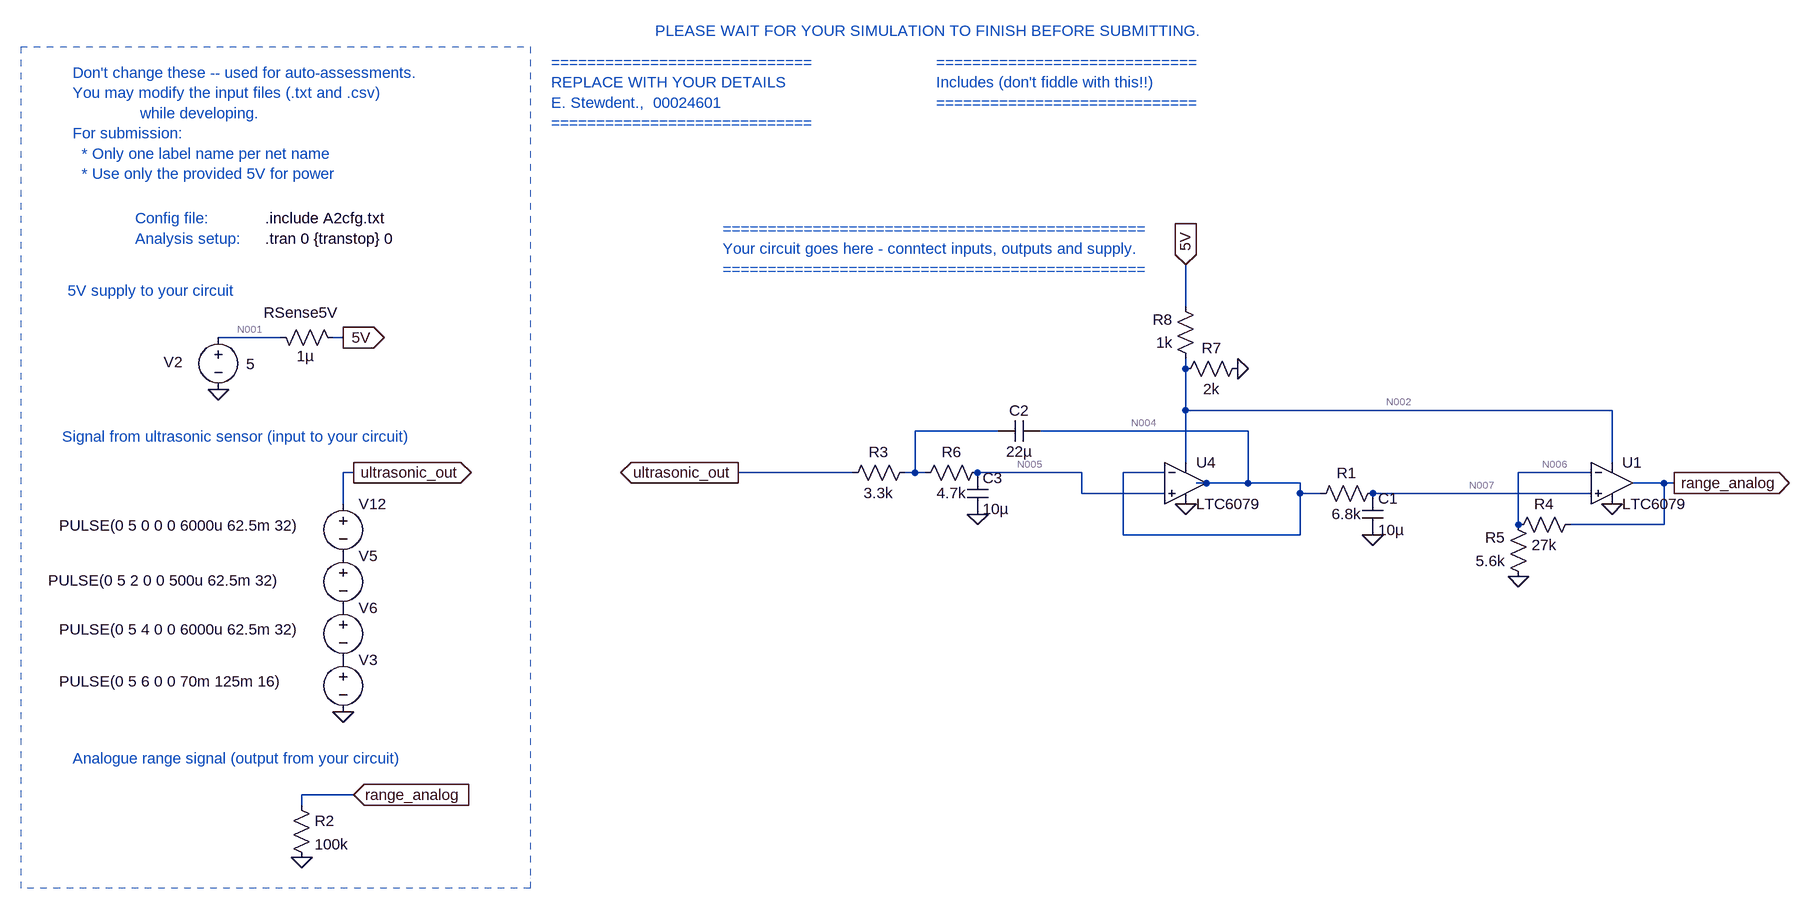
[diagram p0: schematic E344_Ass2_US2A - Copy.asc]
E344_Ass2_US2A - Copy.asc, the LTspice schematic file:
Version 4
SHEET 1 3140 2124
WIRE -576 -1024 -576 -1088
WIRE -1968 -976 -2064 -976
WIRE -1872 -976 -1888 -976
WIRE -576 -928 -576 -944
WIRE -576 -864 -576 -928
WIRE 80 -864 -576 -864
WIRE -864 -832 -992 -832
WIRE -480 -832 -800 -832
WIRE -576 -784 -576 -864
WIRE 80 -784 80 -864
WIRE -1856 -768 -1872 -768
WIRE -1088 -768 -1264 -768
WIRE -992 -768 -992 -832
WIRE -992 -768 -1008 -768
WIRE -976 -768 -992 -768
WIRE -736 -768 -896 -768
WIRE -608 -768 -672 -768
WIRE 48 -768 -64 -768
WIRE -544 -752 -560 -752
WIRE -480 -752 -480 -832
WIRE -480 -752 -544 -752
WIRE -400 -752 -480 -752
WIRE 160 -752 112 -752
WIRE 176 -752 160 -752
WIRE -736 -736 -736 -768
WIRE -608 -736 -736 -736
WIRE -400 -736 -400 -752
WIRE -368 -736 -400 -736
WIRE 48 -736 -288 -736
WIRE -1872 -720 -1872 -768
WIRE -64 -688 -64 -768
WIRE 160 -688 160 -752
WIRE 160 -688 16 -688
WIRE -672 -672 -672 -768
WIRE -400 -672 -400 -736
WIRE -400 -672 -672 -672
WIRE -1856 -272 -1936 -272
WIRE -1936 -256 -1936 -272
FLAG -1872 -976 5V
IOPIN -1872 -976 Out
FLAG -2064 -896 0
FLAG -576 -1088 5V
IOPIN -576 -1088 In
FLAG -1872 -400 0
FLAG -1856 -768 ultrasonic_out
IOPIN -1856 -768 Out
FLAG -1264 -768 ultrasonic_out
IOPIN -1264 -768 Out
FLAG 176 -752 range_analog
IOPIN 176 -752 Out
FLAG -1856 -272 range_analog
IOPIN -1856 -272 In
FLAG -1936 -176 0
FLAG -576 -720 0
FLAG -896 -704 0
FLAG -496 -928 0
FLAG 80 -720 0
FLAG -64 -608 0
FLAG -288 -672 0
SYMBOL voltage -2064 -992 R0
WINDOW 123 0 0 Left 0
WINDOW 39 0 0 Left 0
WINDOW 0 -84 54 Left 2
WINDOW 3 43 57 Left 2
SYMATTR InstName V2
SYMATTR Value 5
SYMBOL res -1984 -992 M90
WINDOW 0 -7 47 VBottom 2
WINDOW 3 29 54 VTop 2
SYMATTR InstName RSense5V
SYMATTR Value 1µ
SYMBOL Opamps\\LTC6079 -576 -752 R0
SYMATTR InstName U4
SYMBOL voltage -1872 -736 R0
WINDOW 123 0 0 Left 0
WINDOW 39 0 0 Left 0
WINDOW 3 -437 49 Left 2
SYMATTR Value PULSE(0 5 0 0 0 6000u 62.5m 32)
SYMATTR InstName V12
SYMBOL voltage -1872 -656 R0
WINDOW 123 0 0 Left 0
WINDOW 39 0 0 Left 0
WINDOW 3 -454 54 Left 2
SYMATTR Value PULSE(0 5 2 0 0 500u 62.5m 32)
SYMATTR InstName V5
SYMBOL voltage -1872 -576 R0
WINDOW 123 0 0 Left 0
WINDOW 39 0 0 Left 0
WINDOW 3 -437 49 Left 2
SYMATTR Value PULSE(0 5 4 0 0 6000u 62.5m 32)
SYMATTR InstName V6
SYMBOL voltage -1872 -496 R0
WINDOW 123 0 0 Left 0
WINDOW 39 0 0 Left 0
WINDOW 3 -437 49 Left 2
SYMATTR Value PULSE(0 5 6 0 0 70m 125m 16)
SYMATTR InstName V3
SYMBOL res -1952 -272 R0
SYMATTR InstName R2
SYMATTR Value 100k
SYMBOL res -992 -784 R90
WINDOW 0 0 56 VBottom 2
WINDOW 3 32 56 VTop 2
SYMATTR InstName R3
SYMATTR Value 3.3k
SYMBOL cap -800 -848 R90
WINDOW 0 0 32 VBottom 2
WINDOW 3 32 32 VTop 2
SYMATTR InstName C2
SYMATTR Value 22µ
SYMBOL cap -912 -768 R0
SYMATTR InstName C3
SYMATTR Value 10µ
SYMBOL res -880 -784 R90
WINDOW 0 0 56 VBottom 2
WINDOW 3 32 56 VTop 2
SYMATTR InstName R6
SYMATTR Value 4.7k
SYMBOL res -480 -944 R90
WINDOW 0 0 56 VBottom 2
WINDOW 3 32 56 VTop 2
SYMATTR InstName R7
SYMATTR Value 2k
SYMBOL res -560 -928 R180
WINDOW 0 36 76 Left 2
WINDOW 3 36 40 Left 2
SYMATTR InstName R8
SYMATTR Value 1k
SYMBOL cap -304 -736 R0
SYMATTR InstName C1
SYMATTR Value 10µ
SYMBOL res -272 -752 R90
WINDOW 0 0 56 VBottom 2
WINDOW 3 32 56 VTop 2
SYMATTR InstName R1
SYMATTR Value 6.8k
SYMBOL res 32 -704 R90
WINDOW 0 0 56 VBottom 2
WINDOW 3 32 56 VTop 2
SYMATTR InstName R4
SYMATTR Value 27k
SYMBOL res -48 -592 R180
WINDOW 0 36 76 Left 2
WINDOW 3 36 40 Left 2
SYMATTR InstName R5
SYMATTR Value 5.6k
SYMBOL Opamps\\LTC6079 80 -752 R0
SYMATTR InstName U1
TEXT -1992 -1128 Left 2 !.tran 0 {transtop} 0
TEXT -1992 -1160 Left 2 !.include A2cfg.txt
TEXT -2288 -1384 Left 2 ;Don't change these -- used for auto-assessments.\nYou may modify the input files (.txt and .csv) \n               while developing.\nFor submission: \n  * Only one label name per net name\n  * Use only the provided 5V for power
TEXT -2192 -1160 Left 2 ;Config file:
TEXT -2192 -1128 Left 2 ;Analysis setup:
TEXT -1552 -1400 Left 2 ;=============================\nREPLACE WITH YOUR DETAILS\nE. Stewdent.,  00024601\n=============================
TEXT -960 -1400 Left 2 ;=============================\nIncludes (don't fiddle with this!!)\n=============================
TEXT -1288 -1144 Left 2 ;===============================================\nYour circuit goes here - conntect inputs, outputs and supply.\n===============================================
TEXT -1392 -1448 Left 2 ;PLEASE WAIT FOR YOUR SIMULATION TO FINISH BEFORE SUBMITTING.
TEXT -2304 -824 Left 2 ;Signal from ultrasonic sensor (input to your circuit)
TEXT -2296 -1048 Left 2 ;5V supply to your circuit
TEXT -2288 -328 Left 2 ;Analogue range signal (output from your circuit)
LINE Normal -1584 -1424 -1584 -128 2
LINE Normal -2368 -1424 -1584 -1424 2
LINE Normal -1584 -128 -2368 -128 2
LINE Normal -1584 -144 -1584 -144 2
LINE Normal -2368 -1424 -2368 -128 2

The netlist it stands for:
* E344_Ass2_US2A - Copy.asc
V2 N001 0 5
RSense5V N001 5V 1µ
XU4 N005 N004 N002 0 N004 LTC6078  ; LTC6079, pins In+ In- V+ V- OUT
V12 ultrasonic_out P001 PULSE(0 5 0 0 0 6000u 62.5m 32)
V5 P001 P002 PULSE(0 5 2 0 0 500u 62.5m 32)
V6 P002 P003 PULSE(0 5 4 0 0 6000u 62.5m 32)
V3 P003 0 PULSE(0 5 6 0 0 70m 125m 16)
R2 range_analog 0 100k
R3 N003 ultrasonic_out 3.3k
C2 N004 N003 22µ
C3 N005 0 10µ
R6 N005 N003 4.7k
R7 0 N002 2k
R8 N002 5V 1k
C1 N007 0 10µ
R1 N007 N004 6.8k
R4 range_analog N006 27k
R5 0 N006 5.6k
XU1 N007 N006 N002 0 range_analog LTC6078  ; LTC6079, pins In+ In- V+ V- OUT
.tran 0 {transtop} 0
.include A2cfg.txt
* Don't change these -- used for auto-assessments.
* You may modify the input files (.txt and .csv)
*                while developing.
* For submission:
*   * Only one label name per net name
*   * Use only the provided 5V for power
* Config file:
* Analysis setup:
* =============================
* REPLACE WITH YOUR DETAILS
* E. Stewdent.,  00024601
* =============================
* =============================
* Includes (don't fiddle with this!!)
* =============================
* ===============================================
* Your circuit goes here - conntect inputs, outputs and supply.
* ===============================================
* PLEASE WAIT FOR YOUR SIMULATION TO FINISH BEFORE SUBMITTING.
* Signal from ultrasonic sensor (input to your circuit)
* 5V supply to your circuit
* Analogue range signal (output from your circuit)
.lib LTC5.lib
.backanno
.end

* Results of the author's LTspice run, read from the files saved beside the schematic
* Operating Point, zero values left out:
*   V(n001) = 5 V
*   V(5v) = 5 V
*   V(n002) = 3.286 V
*   V(n005) = 9.538 nV
*   V(n004) = 17.46 µV
*   V(range_analog) = 115.6 µV
*   V(n007) = 17.46 µV
*   V(n006) = 19.87 µV
*   I(R5) = -3.548 nA
*   I(R4) = 3.547 nA
*   I(R1) = 1.192 pA
*   I(R8) = -1.714 mA
*   I(R7) = -1.643 mA
*   I(R6) = 1.192 pA
*   I(R3) = 1.192 pA
*   I(R2) = 1.156 nA
*   I(Rsense5v) = 1.714 mA
*   I(V3) = 1.192 pA
*   I(V6) = 1.192 pA
*   I(V5) = 1.192 pA
*   I(V12) = 1.192 pA
*   I(V2) = -1.714 mA
*   Ix(u4:1) = -1.192 pA
*   Ix(u4:2) = -1.192 pA
*   Ix(u4:3) = 35.78 µA
*   Ix(u4:4) = -35.78 µA
*   Ix(u4:5) = 5.67 pA
*   Ix(u1:1) = -1.192 pA
*   Ix(u1:2) = -1.192 pA
*   Ix(u1:3) = 35.8 µA
*   Ix(u1:4) = -35.79 µA
*   Ix(u1:5) = -4.7 nA
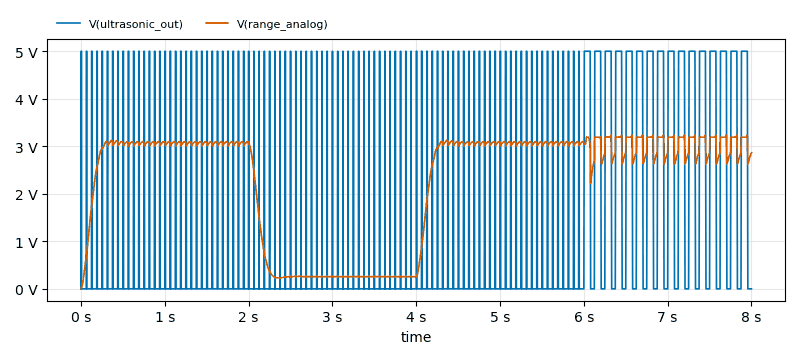
[diagram p1: Transient Analysis of E344_Ass2_US2A - Copy.asc, plotted from the saved traces]
* Transient Analysis, 1 run:
*   V(ultrasonic_out): min 0 V, max 5 V, average 1.03 V, rms 2.241 V, last 0 V
*   V(range_analog): min 115.6 µV, max 3.233 V, average 2.307 V, rms 2.6 V, last 2.864 V